# EasyEDA schematic SCH_5641AS_seven_segment_display_circuit_2024-01-17.json

## Sheets
1 2mA_series_resistors_template_circuit: TITLE: 2mA series resistor driven 5641AS circuit; REV: 1.0; Date: 2024-01-17; Sheet: 1/1; Drawn By: Mortrack8; Company: Your Company
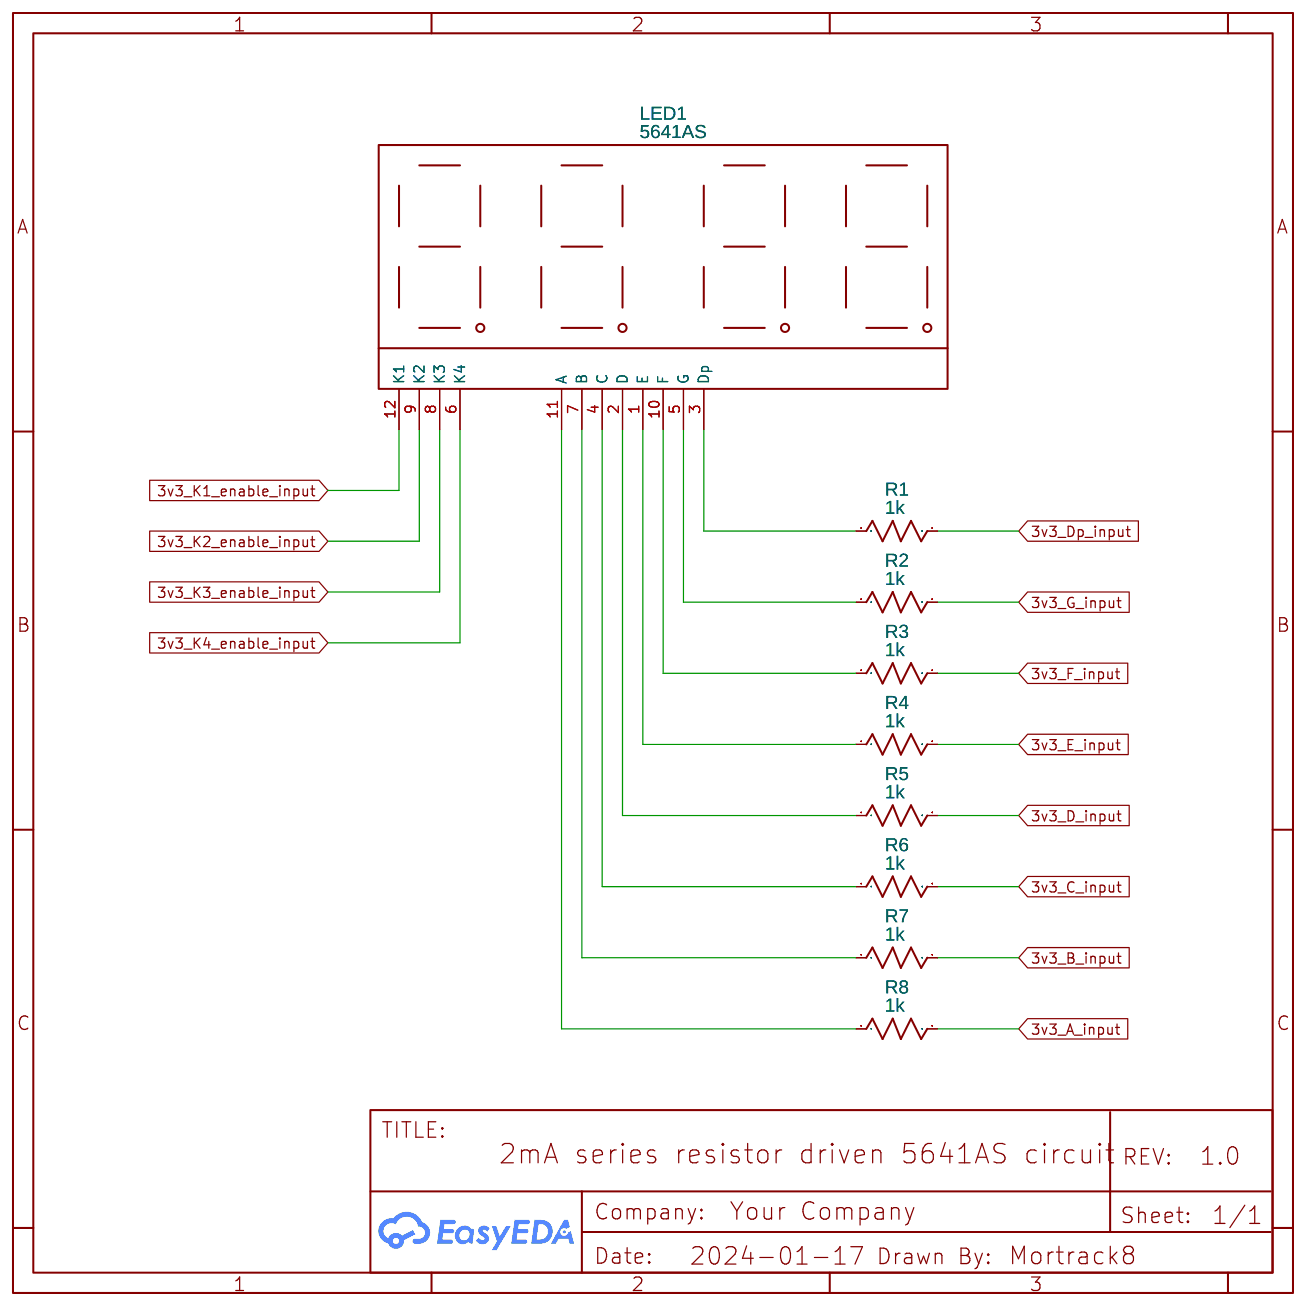
[diagram p0: 2mA_series_resistors_template_circuit]
2 10mA_transistor_template_circuit: TITLE: Sheet_1
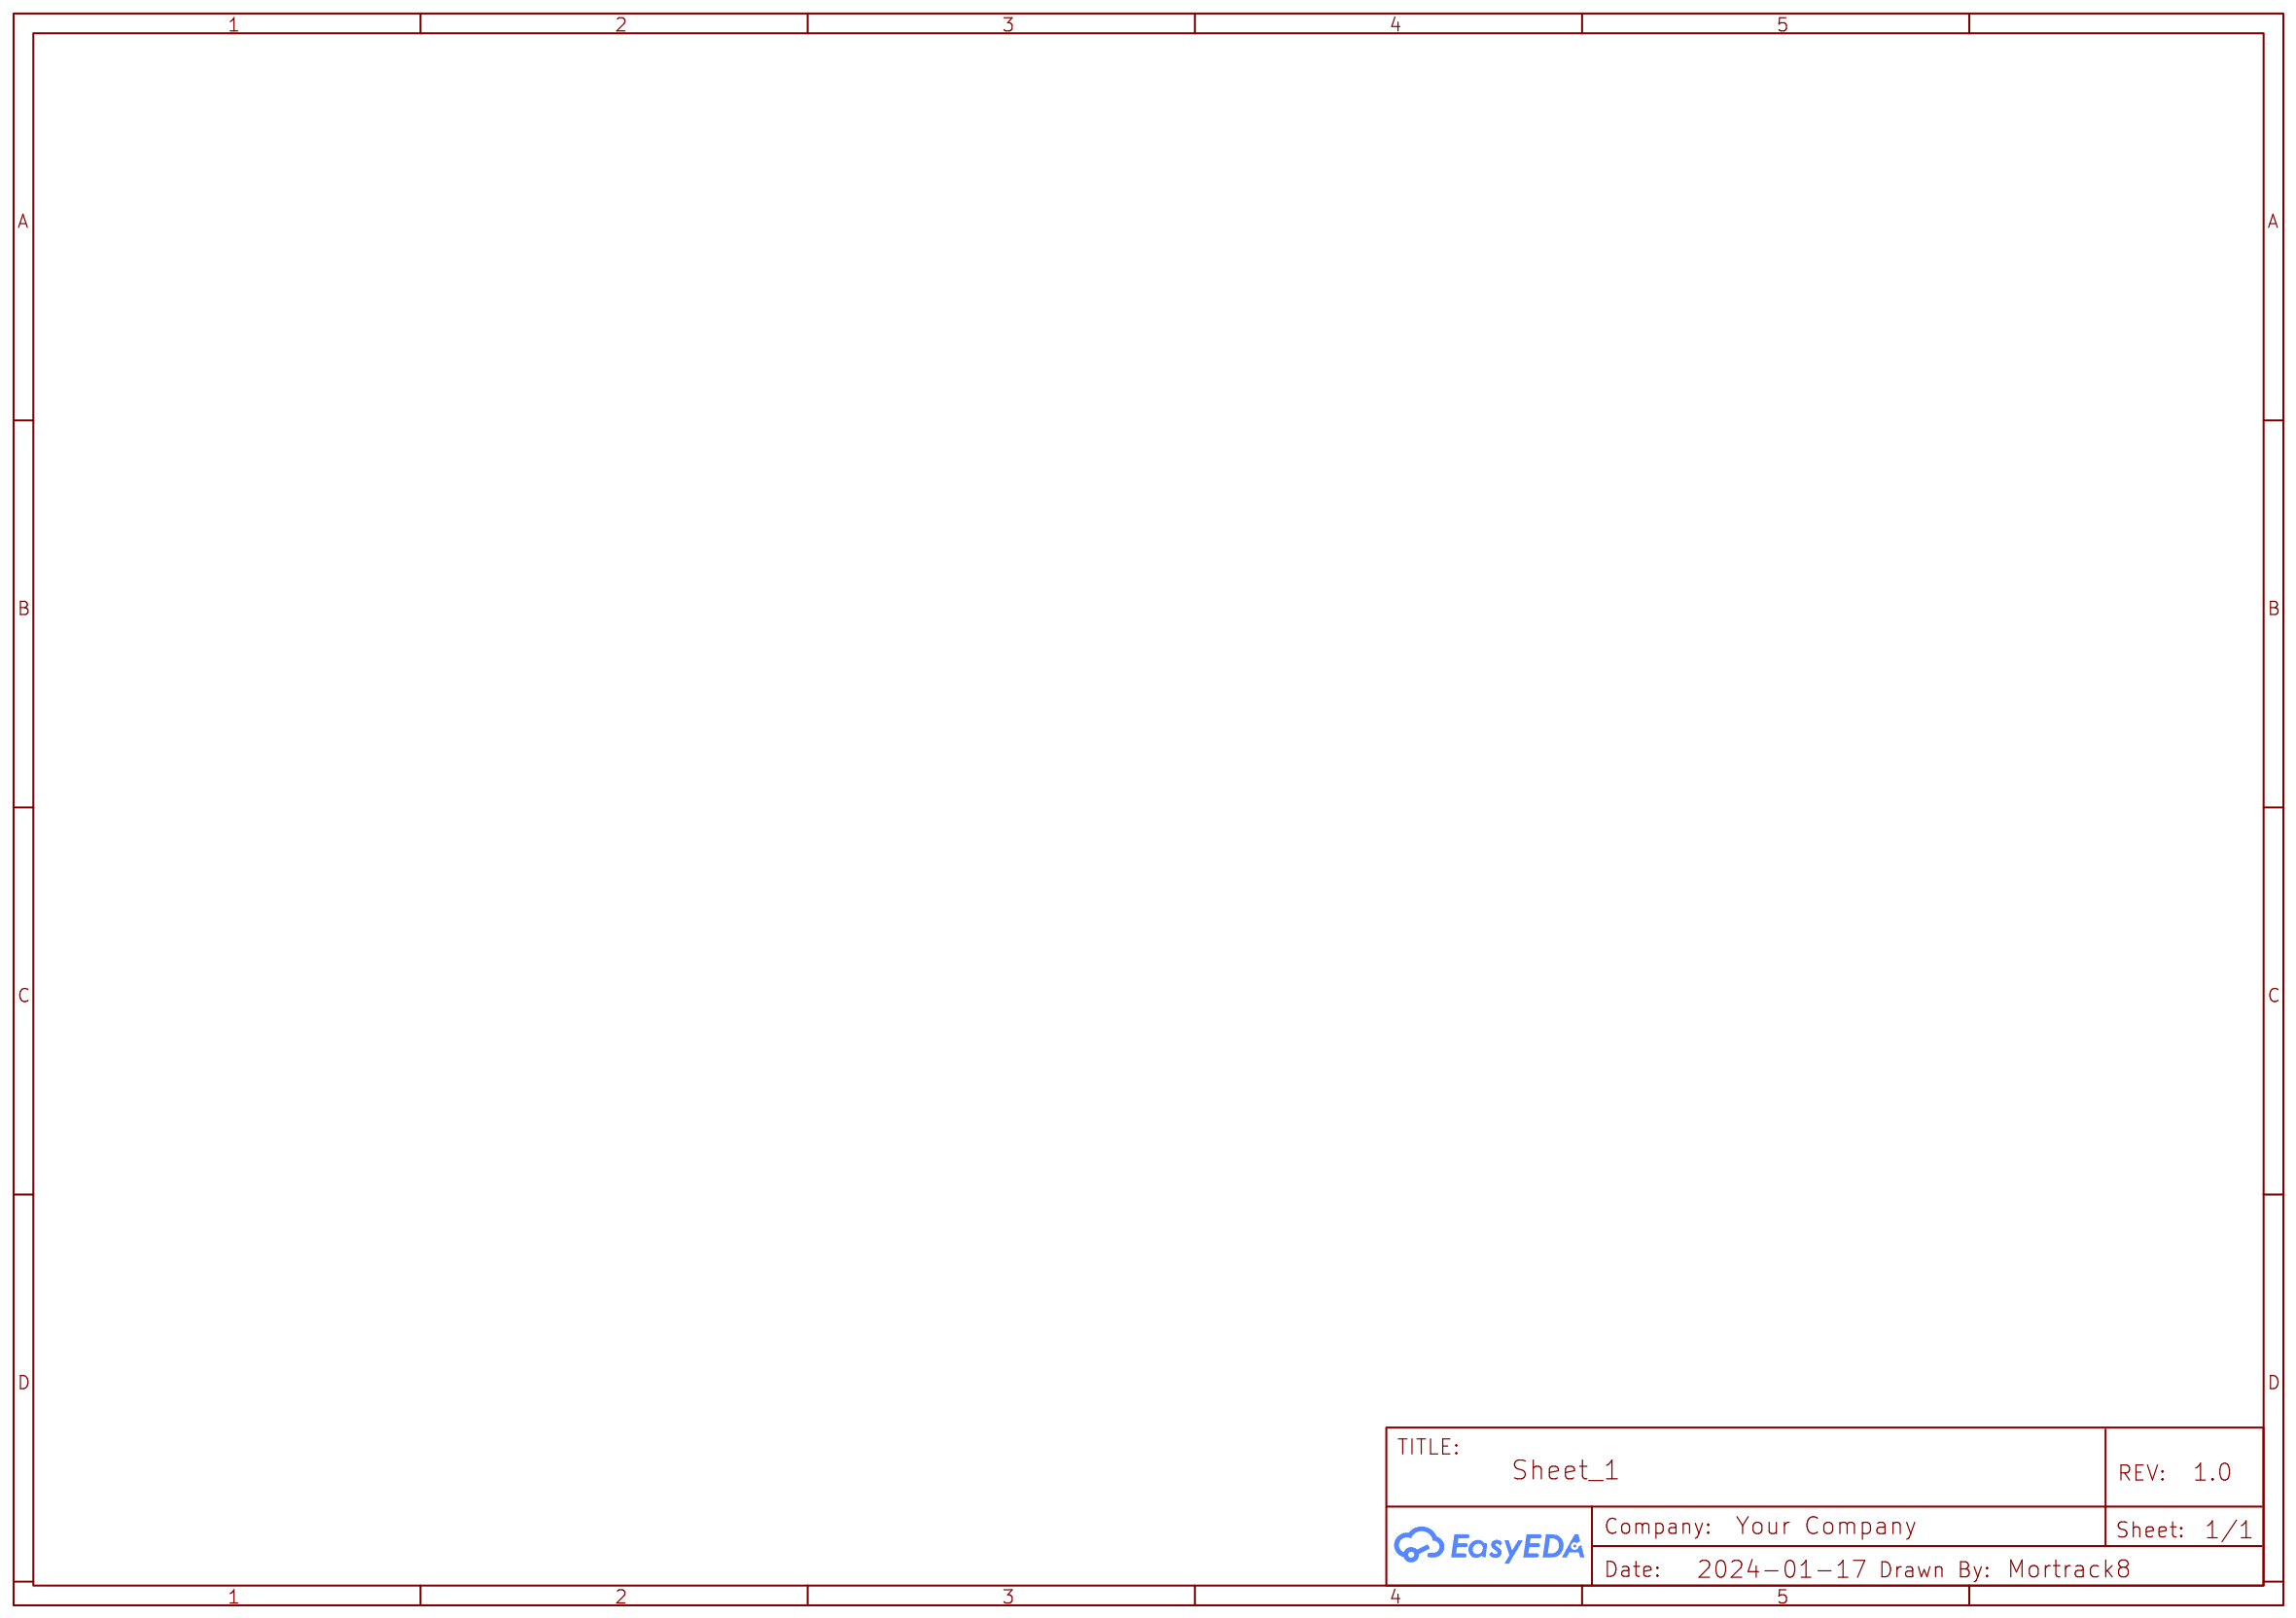
[diagram p1: 10mA_transistor_template_circuit]
3 2mA_series_resistor_5641AS_circuit: Company: None
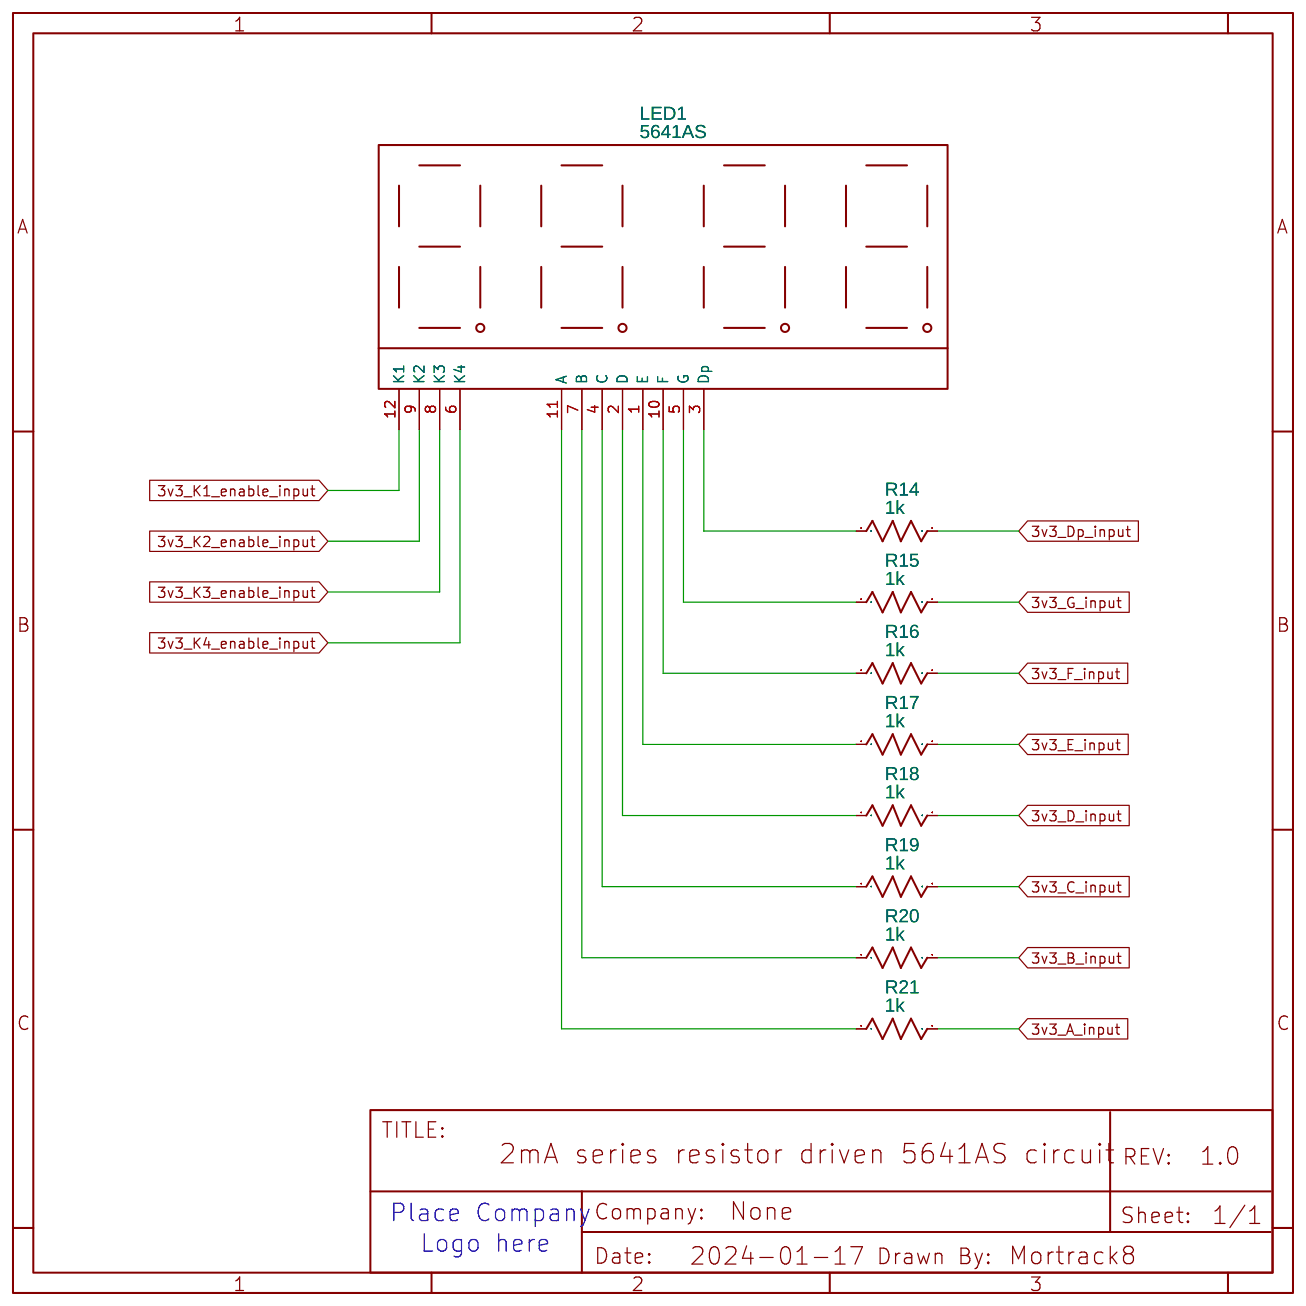
[diagram p2: 2mA_series_resistor_5641AS_circuit]

## Parts
sheet 2mA_series_resistor_5641AS_circuit
LED1#2  5641AS  [5641AS]
R14  1k  [R_AXIAL-0.5]
R15  1k  [R_AXIAL-0.5]
R16  1k  [R_AXIAL-0.5]
R17  1k  [R_AXIAL-0.5]
R18  1k  [R_AXIAL-0.5]
R19  1k  [R_AXIAL-0.5]
R20  1k  [R_AXIAL-0.5]
R21  1k  [R_AXIAL-0.5]
sheet 2mA_series_resistors_template_circuit
LED1  5641AS  [5641AS]
R1  1k  [R_AXIAL-0.5]
R2  1k  [R_AXIAL-0.5]
R3  1k  [R_AXIAL-0.5]
R4  1k  [R_AXIAL-0.5]
R5  1k  [R_AXIAL-0.5]
R6  1k  [R_AXIAL-0.5]
R7  1k  [R_AXIAL-0.5]
R8  1k  [R_AXIAL-0.5]

## Library data of the parts
LED1 LED1#2 = 5641AS: Contributor: Polzuchy_haos
R1-R8 R14-R21 = R_AXIAL-0.5_US: Contributor: LCEDA_Lib

## Nets
3v3_A_input: R8.2 R21.2
3v3_B_input: R7.2 R20.2
3v3_C_input: R6.2 R19.2
3v3_D_input: R5.2 R18.2
3v3_Dp_input: R1.2 R14.2
3v3_E_input: R4.2 R17.2
3v3_F_input: R3.2 R16.2
3v3_G_input: R2.2 R15.2
3v3_K1_enable_input: LED1.12(K1) LED1#2.12(K1)
3v3_K2_enable_input: LED1.9(K2) LED1#2.9(K2)
3v3_K3_enable_input: LED1.8(K3) LED1#2.8(K3)
3v3_K4_enable_input: LED1.6(K4) LED1#2.6(K4)
Net-(LED1#2-1): LED1#2.1(E) R17.1
Net-(LED1#2-2): LED1#2.2(D) R18.1
Net-(LED1#2-3): LED1#2.3(Dp) R14.1
Net-(LED1#2-4): LED1#2.4(C) R19.1
Net-(LED1#2-5): LED1#2.5(G) R15.1
Net-(LED1#2-7): LED1#2.7(B) R20.1
Net-(LED1#2-10): LED1#2.10(F) R16.1
Net-(LED1#2-11): LED1#2.11(A) R21.1
Net-(LED1-1): LED1.1(E) R4.1
Net-(LED1-2): LED1.2(D) R5.1
Net-(LED1-3): LED1.3(Dp) R1.1
Net-(LED1-4): LED1.4(C) R6.1
Net-(LED1-5): LED1.5(G) R2.1
Net-(LED1-7): LED1.7(B) R7.1
Net-(LED1-10): LED1.10(F) R3.1
Net-(LED1-11): LED1.11(A) R8.1

## Notes on the sheets
sheet 3
- Place Company
- Logo here
